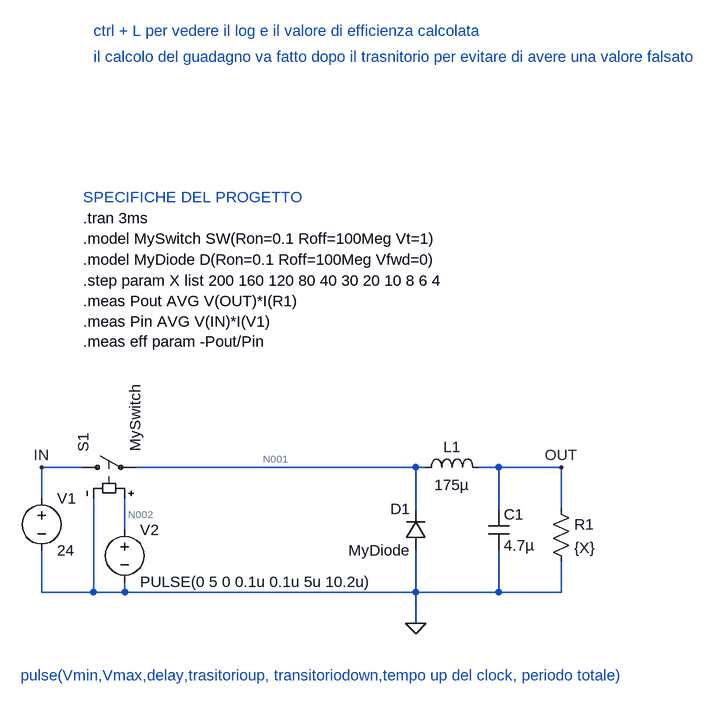
[diagram p0: schematic buck ideale.asc]
buck ideale.asc, the LTspice schematic file:
Version 4
SHEET 1 1372 680
WIRE -272 -32 -336 -32
WIRE 240 -32 -192 -32
WIRE 256 -32 240 -32
WIRE 368 -32 336 -32
WIRE 464 -32 368 -32
WIRE -336 16 -336 -32
WIRE 240 32 240 -32
WIRE 368 32 368 -32
WIRE 464 32 464 -32
WIRE -208 64 -208 16
WIRE -336 160 -336 96
WIRE -256 160 -256 16
WIRE -256 160 -336 160
WIRE -208 160 -208 144
WIRE -208 160 -256 160
WIRE 240 160 240 96
WIRE 240 160 -208 160
WIRE 368 160 368 96
WIRE 368 160 240 160
WIRE 464 160 464 112
WIRE 464 160 368 160
WIRE 240 208 240 160
FLAG 240 208 0
FLAG 464 -32 OUT
FLAG -336 -32 IN
SYMBOL cap 352 32 R0
SYMATTR InstName C1
SYMATTR Value 4.7µ
SYMBOL ind 240 -16 R270
WINDOW 0 32 56 VTop 2
WINDOW 3 5 56 VBottom 2
SYMATTR InstName L1
SYMATTR Value 175µ
SYMBOL diode 256 96 R180
WINDOW 0 24 64 Left 2
WINDOW 3 24 0 Left 2
SYMATTR InstName D1
SYMATTR Value MyDiode
SYMBOL res 448 16 R0
SYMATTR InstName R1
SYMATTR Value {X}
SYMBOL voltage -336 0 R0
WINDOW 123 0 0 Left 0
WINDOW 39 0 0 Left 0
SYMATTR InstName V1
SYMATTR Value 24
SYMBOL sw -288 -32 R270
SYMATTR InstName S1
SYMATTR Value MySwitch
SYMBOL voltage -208 48 R0
WINDOW 123 0 0 Left 0
WINDOW 39 0 0 Left 0
SYMATTR InstName V2
SYMATTR Value PULSE(0 5 0 0.1u 0.1u 5u 10.2u)
TEXT -272 -416 Left 2 !.tran 3ms
TEXT -272 -384 Left 2 !.model MySwitch SW(Ron=0.1 Roff=100Meg Vt=1)
TEXT -272 -352 Left 2 !.model MyDiode D(Ron=0.1 Roff=100Meg Vfwd=0)
TEXT -272 -448 Left 2 ;SPECIFICHE DEL PROGETTO
TEXT -368 288 Left 2 ;pulse(Vmin,Vmax,delay,trasitorioup, transitoriodown,tempo up del clock, periodo totale)
TEXT -272 -320 Left 2 !.step param X list 200 160 120 80 40 30 20 10 8 6 4
TEXT -272 -288 Left 2 !.meas Pout AVG V(OUT)*I(R1)\n.meas Pin AVG V(IN)*I(V1)\n.meas eff param -Pout/Pin
TEXT -256 -704 Left 2 ;ctrl + L per vedere il log e il valore di efficienza calcolata
TEXT -256 -664 Left 2 ;il calcolo del guadagno va fatto dopo il trasnitorio per evitare di avere una valore falsato

The netlist it stands for:
* buck ideale.asc
C1 OUT 0 4.7µ
L1 N001 OUT 175µ
D1 0 N001 MyDiode
R1 OUT 0 {X}
V1 IN 0 24
S1 IN N001 N002 0 MySwitch
V2 N002 0 PULSE(0 5 0 0.1u 0.1u 5u 10.2u)
.model D D
.lib standard.dio
.tran 3ms
.model MySwitch SW(Ron=0.1 Roff=100Meg Vt=1)
.model MyDiode D(Ron=0.1 Roff=100Meg Vfwd=0)
* SPECIFICHE DEL PROGETTO
* pulse(Vmin,Vmax,delay,trasitorioup, transitoriodown,tempo up del clock, periodo totale)
.step param X list 200 160 120 80 40 30 20 10 8 6 4
.meas Pout AVG V(OUT)*I(R1)
.meas Pin AVG V(IN)*I(V1)
.meas eff param -Pout/Pin
* ctrl + L per vedere il log e il valore di efficienza calcolata
* il calcolo del guadagno va fatto dopo il trasnitorio per evitare di avere una valore falsato
.backanno
.end

* Results of the author's LTspice run, read from the files saved beside the schematic
* Operating Point (first step), zero values left out:
*   x = 10 
*   V(out) = 2.4 µV
*   V(n001) = 2.4 µV
*   V(in) = 24 V
*   I(L1) = 240 nA
*   I(R1) = 240 nA
*   I(S1) = -240 nA
*   I(V1) = -240 nA
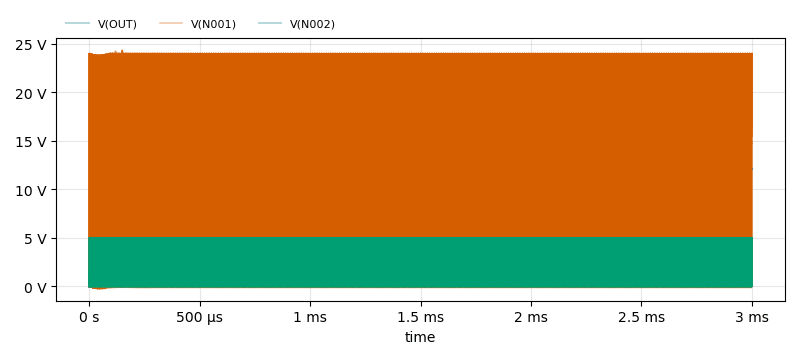
[diagram p1: Transient Analysis of buck ideale.asc, plotted from the saved traces]
* Transient Analysis, 8 runs:
*   V(OUT) [x=10]: min 2.4 µV, max 16.37 V, average 11.97 V, rms 12.03 V, last 11.99 V
*   V(OUT) [x=40]: min 9.601 µV, max 21.47 V, average 12.28 V, rms 12.39 V, last 12.08 V
*   V(OUT) [x=70]: min 16.8 µV, max 22.51 V, average 12.63 V, rms 12.79 V, last 12.14 V
*   V(OUT) [x=100]: min 24 µV, max 22.95 V, average 14.12 V, rms 14.27 V, last 13.59 V
*   V(OUT) [x=130]: min 31.2 µV, max 23.2 V, average 15.21 V, rms 15.35 V, last 14.68 V
*   V(OUT) [x=160]: min 38.4 µV, max 23.35 V, average 16.05 V, rms 16.19 V, last 15.52 V
*   V(OUT) [x=190]: min 45.6 µV, max 23.46 V, average 16.73 V, rms 16.87 V, last 16.22 V
*   V(OUT) [x=200]: min 48 µV, max 23.49 V, average 16.93 V, rms 17.07 V, last 16.42 V
*   V(N001) [x=10]: min -244.5 mV, max 24 V, average 12.01 V, rms 16.96 V, last 23.89 V
*   V(N001) [x=40]: min -221.1 mV, max 24 V, average 12.28 V, rms 17.12 V, last 23.98 V
*   V(N001) [x=70]: min -217.8 mV, max 24 V, average 12.62 V, rms 17.29 V, last 23.99 V
*   V(N001) [x=100]: min -216.4 mV, max 24.25 V, average 14.1 V, rms 17.91 V, last 23.99 V
*   V(N001) [x=130]: min -215.7 mV, max 24 V, average 15.19 V, rms 18.43 V, last 23.99 V
*   V(N001) [x=160]: min -215.2 mV, max 24.34 V, average 16.04 V, rms 18.87 V, last 23.99 V
*   V(N001) [x=190]: min -214.9 mV, max 24 V, average 16.73 V, rms 19.24 V, last 23.99 V
*   V(N001) [x=200]: min -214.8 mV, max 24 V, average 16.93 V, rms 19.35 V, last 23.99 V
*   V(N002) [x=10]: min 0 V, max 5 V, average 2.501 V, rms 3.526 V, last 5 V
*   V(N002) [x=40]: min 0 V, max 5 V, average 2.501 V, rms 3.528 V, last 5 V
*   V(N002) [x=70]: min 0 V, max 5 V, average 2.501 V, rms 3.528 V, last 5 V
*   V(N002) [x=100]: min 0 V, max 5 V, average 2.501 V, rms 3.528 V, last 5 V
*   V(N002) [x=130]: min 0 V, max 5 V, average 2.501 V, rms 3.528 V, last 5 V
*   V(N002) [x=160]: min 0 V, max 5 V, average 2.501 V, rms 3.528 V, last 5 V
*   V(N002) [x=190]: min 0 V, max 5 V, average 2.501 V, rms 3.528 V, last 5 V
*   V(N002) [x=200]: min 0 V, max 5 V, average 2.501 V, rms 3.528 V, last 5 V